# EAGLE schematic Melanie-AD (EAGLE 4.11)
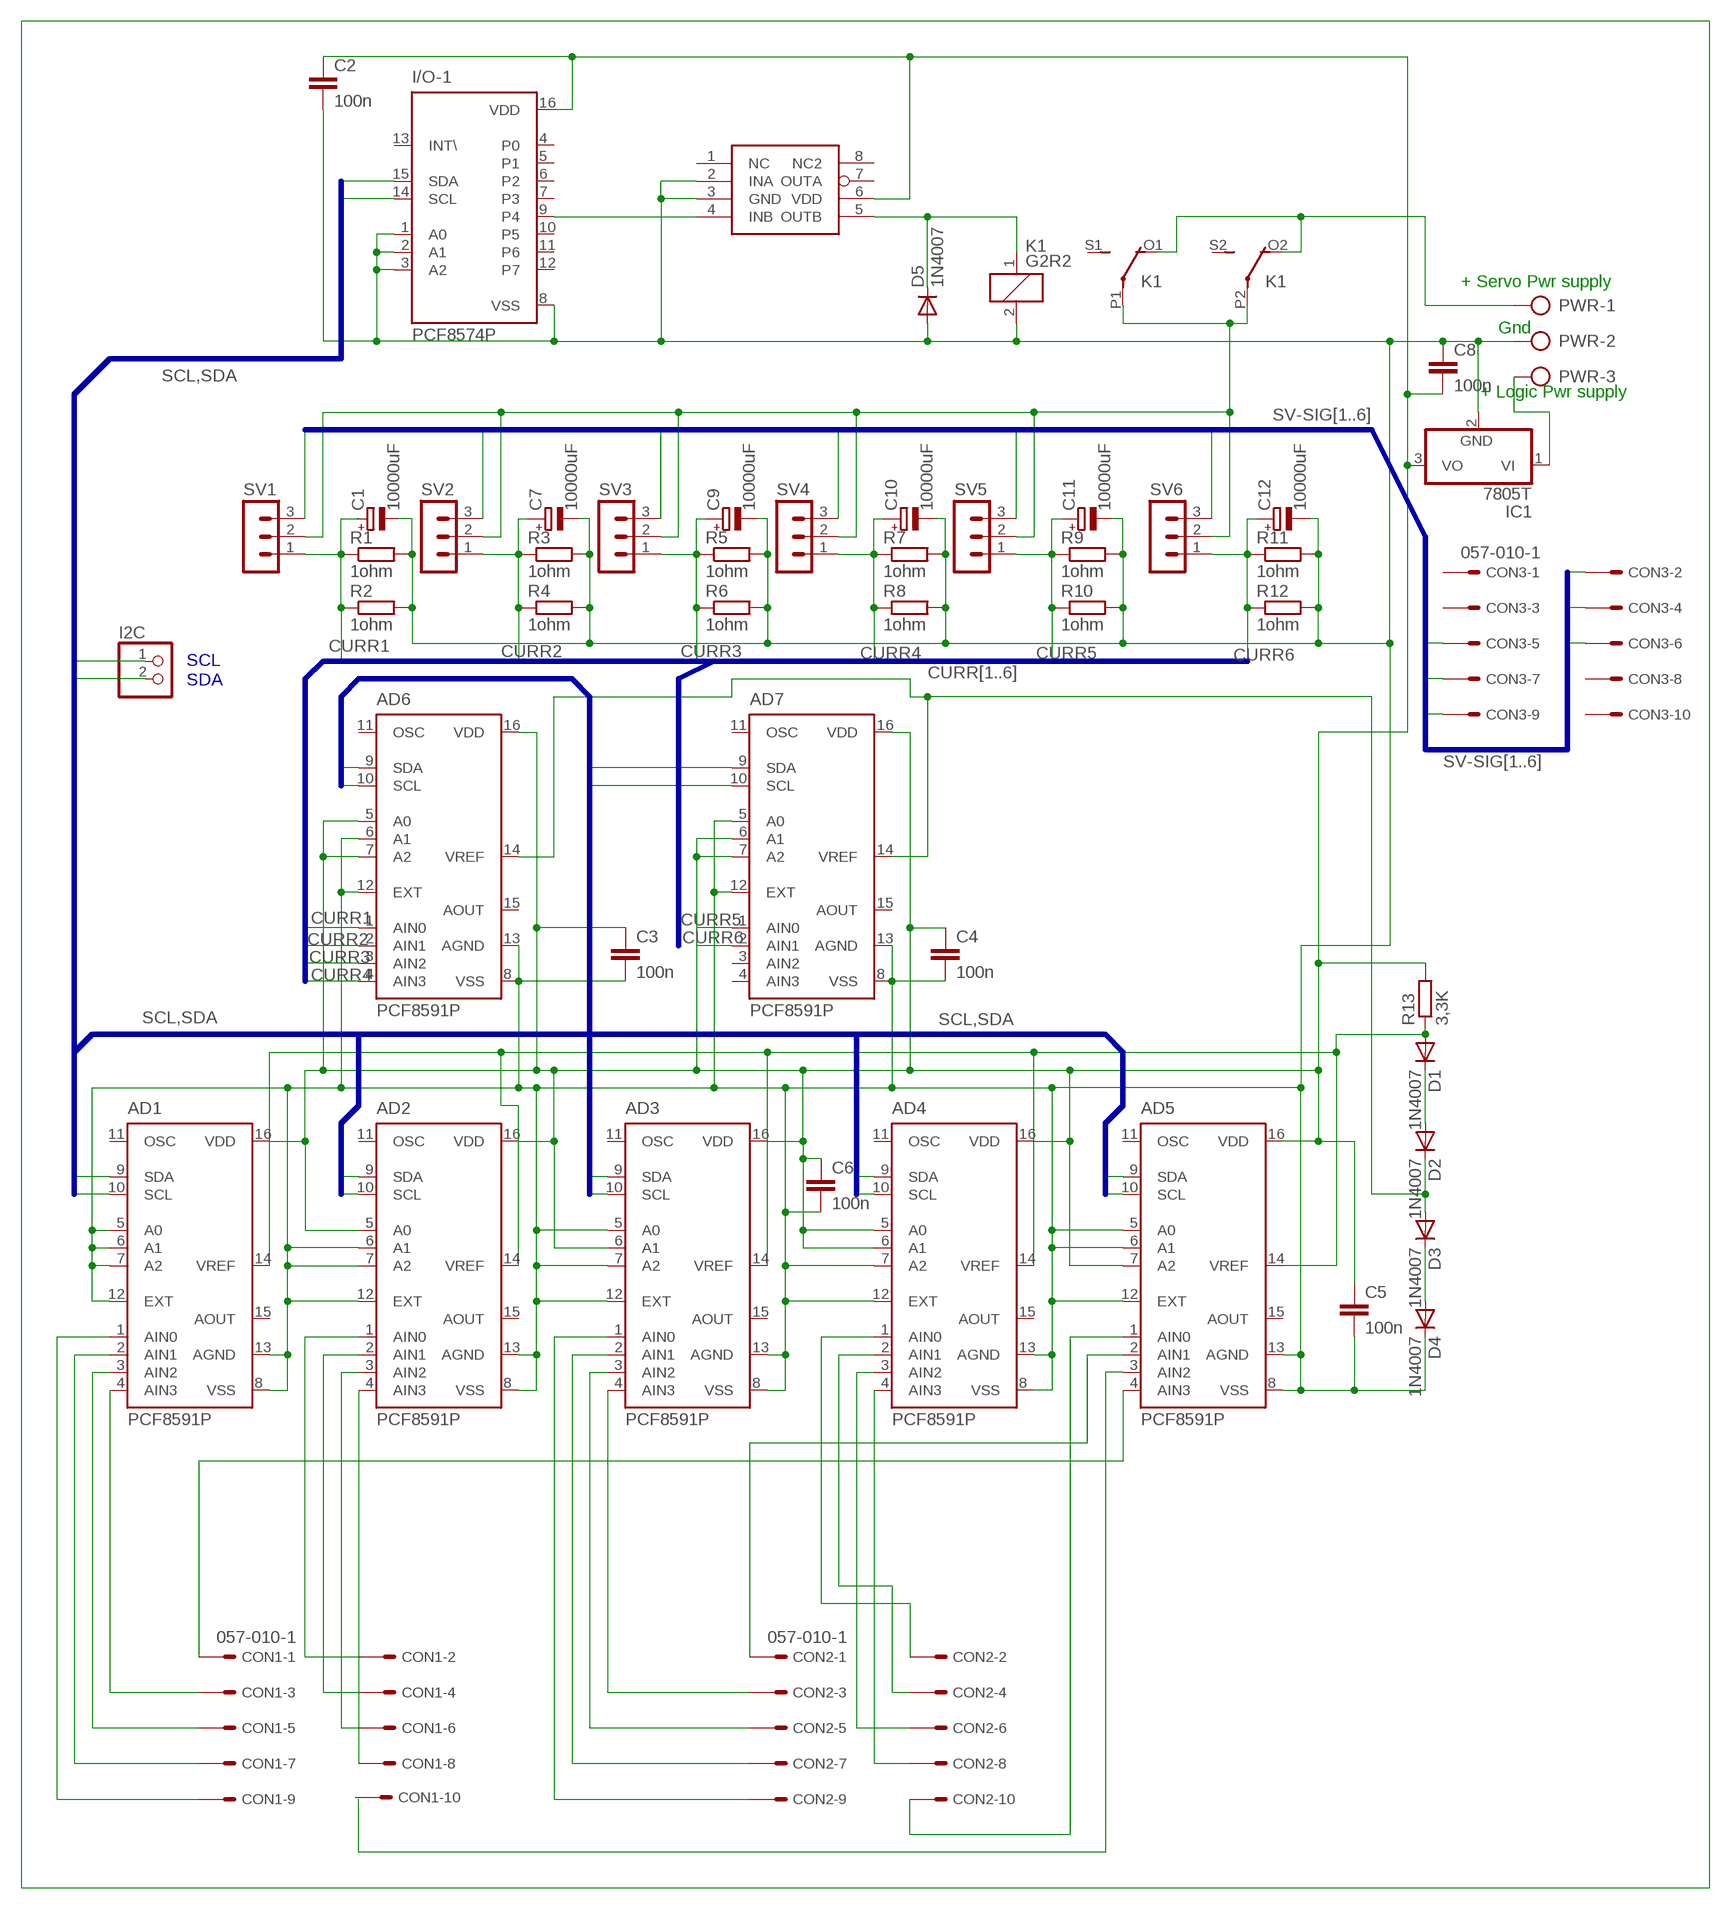
[diagram p0: schematic, sheet 1]

## Parts
AD1  PCF8591P  [DIL16]
AD2  PCF8591P  [DIL16]
AD3  PCF8591P  [DIL16]
AD4  PCF8591P  [DIL16]
AD5  PCF8591P  [DIL16]
AD6  PCF8591P  [DIL16]
AD7  PCF8591P  [DIL16]
C1  10000uF  CPOL-EUE10-22.5  [EB22,5D]
C2  100n  C-EU025-025X050  [C025-025X050]
C3  100n  C-EU025-025X050  [C025-025X050]
C4  100n  C-EU025-025X050  [C025-025X050]
C5  100n  C-EU025-025X050  [C025-025X050]
C6  100n  C-EU025-025X050  [C025-025X050]
C7  10000uF  CPOL-EUE10-22.5  [EB22,5D]
C8  100n  C-EU025-025X050  [C025-025X050]
C9  10000uF  CPOL-EUE10-22.5  [EB22,5D]
C10  10000uF  CPOL-EUE10-22.5  [EB22,5D]
C11  10000uF  CPOL-EUE10-22.5  [EB22,5D]
C12  10000uF  CPOL-EUE10-22.5  [EB22,5D]
CON1  057-010-1  [057-010-1]
CON2  057-010-1  [057-010-1]
CON3  057-010-1  [057-010-1]
D1  1N4007  1N4004  [DO41-10]
D2  1N4007  1N4004  [DO41-10]
D3  1N4007  1N4004  [DO41-10]
D4  1N4007  1N4004  [DO41-10]
D5  1N4007  1N4004  [DO41-10]
I2C  PINHD-1X2  [1X02]
I/O-1  PCF8574P  [DIL16]
IC1  7805T  [TO220H]
K1  G2R2  [G2R2]
PWR  AK300/3  [AK300/3]
R1  1ohm  R-EU_0414/5V  [0414V]
R2  1ohm  R-EU_0414/5V  [0414V]
R3  1ohm  R-EU_0414/5V  [0414V]
R4  1ohm  R-EU_0414/5V  [0414V]
R5  1ohm  R-EU_0414/5V  [0414V]
R6  1ohm  R-EU_0414/5V  [0414V]
R7  1ohm  R-EU_0414/5V  [0414V]
R8  1ohm  R-EU_0414/5V  [0414V]
R9  1ohm  R-EU_0414/5V  [0414V]
R10  1ohm  R-EU_0414/5V  [0414V]
R11  1ohm  R-EU_0414/5V  [0414V]
R12  1ohm  R-EU_0414/5V  [0414V]
R13  3,3K  R-EU_0309/10  [0309/10]
SV1  MA03-1  [MA03-1]
SV2  MA03-1  [MA03-1]
SV3  MA03-1  [MA03-1]
SV4  MA03-1  [MA03-1]
SV5  MA03-1  [MA03-1]
SV6  MA03-1  [MA03-1]
U$1  TC4425  [DIL08]

## Nets
CURR1: AD6.1(AIN0) R1.1 R2.1 SV1.1
CURR2: AD6.2(AIN1) C7.+ R3.1 R4.1 SV2.1
CURR3: AD6.3(AIN2) C9.+ R5.1 R6.1 SV3.1
CURR4: AD6.4(AIN3) C10.+ R7.1 R8.1 SV4.1
CURR5: AD7.1(AIN0) R9.1 R10.1 SV5.1
CURR6: AD7.2(AIN1) C12.+ R11.1 R12.1 SV6.1
N$1: AD1.1(AIN0) CON1.9
N$2: AD1.2(AIN1) CON1.7
N$3: AD1.3(AIN2) CON1.5
N$4: AD4.4(AIN3) CON2.8
N$5: AD2.1(AIN0) CON1.2
N$6: AD2.2(AIN1) CON1.4
N$7: AD2.3(AIN2) CON1.6
N$8: AD2.4(AIN3) CON1.8
N$9: AD3.1(AIN0) CON2.9
N$10: AD3.2(AIN1) CON2.7
N$11: AD3.3(AIN2) CON2.5
N$12: AD3.4(AIN3) CON2.3
N$13: AD4.3(AIN2) CON2.6
N$14: AD4.2(AIN1) CON2.4
N$15: AD4.1(AIN0) CON2.2
N$16: AD5.3(AIN2)
N$17: AD5.1(AIN0) CON2.10
N$18: AD5.2(AIN1) CON2.1
N$19: D3.C D4.A
N$20: K1.P1(2:P) K1.P2(3:P) SV1.2 SV2.2 SV3.2 SV4.2 SV5.2 SV6.2
N$21: AD1.4(AIN3) CON1.3
N$22: I/O-1.9(P4) U$1.4(INB)
N$23: D5.C K1.1 U$1.5(OUTB)
N$24: K1.O1(2:O) K1.O2(3:O) PWR.1
N$27: D1.C D2.A
N$28: AD5.4(AIN3) CON1.1
N$31: IC1.1(VI) PWR.3
SCL: AD1.10(SCL) AD2.10(SCL) AD3.10(SCL) AD4.10(SCL) AD5.10(SCL) AD6.10(SCL) AD7.10(SCL) I2C.1 I/O-1.14(SCL)
SDA: AD1.9(SDA) AD2.9(SDA) AD3.9(SDA) AD4.9(SDA) AD5.9(SDA) AD6.9(SDA) AD7.9(SDA) I2C.2 I/O-1.15(SDA)
SV-SIG1: CON3.2 SV1.3
SV-SIG2: CON3.4 SV2.3
SV-SIG3: CON3.6 SV3.3
SV-SIG4: CON3.9 SV4.3
SV-SIG5: CON3.7 SV5.3
SV-SIG6: CON3.5 SV6.3
VDD: AD1.16(VDD) AD2.5(A0) AD2.16(VDD) AD3.6(A1) AD3.16(VDD) AD4.5(A0) AD4.6(A1) AD4.16(VDD) AD5.7(A2) AD5.16(VDD) AD6.5(A0) AD6.7(A2) AD6.16(VDD) AD7.6(A1) AD7.7(A2) AD7.16(VDD) C2.1 C3.1 C4.1 C5.1 C6.1 C8.2 I/O-1.16(VDD) IC1.3(VO) R13.2 U$1.6(VDD)
VREF-CURR: AD6.14(VREF) AD7.14(VREF) D2.C D3.A
VREF-POT: AD1.14(VREF) AD2.14(VREF) AD3.14(VREF) AD4.14(VREF) AD5.14(VREF) D1.A R13.1
VSS: AD1.5(A0) AD1.6(A1) AD1.7(A2) AD1.8(VSS) AD1.12(EXT) AD1.13(AGND) AD2.6(A1) AD2.7(A2) AD2.8(VSS) AD2.12(EXT) AD2.13(AGND) AD3.5(A0) AD3.7(A2) AD3.8(VSS) AD3.12(EXT) AD3.13(AGND) AD4.7(A2) AD4.8(VSS) AD4.12(EXT) AD4.13(AGND) AD5.5(A0) AD5.6(A1) AD5.8(VSS) AD5.12(EXT) AD5.13(AGND) AD6.6(A1) AD6.8(VSS) AD6.12(EXT) AD6.13(AGND) AD7.5(A0) AD7.8(VSS) AD7.12(EXT) AD7.13(AGND) C2.2 C3.2 C4.2 C5.2 C6.2 C8.1 C10.- C12.- D4.C D5.A I/O-1.1(A0) I/O-1.2(A1) I/O-1.3(A2) I/O-1.8(VSS) IC1.2(GND) K1.2 PWR.2 R1.2 R2.2 R3.2 R4.2 R5.2 R6.2 R7.2 R8.2 R9.2 R10.2 R11.2 R12.2 U$1.2(INA) U$1.3(GND)
Unconnected: AD1.11(OSC) AD1.15(AOUT) AD2.11(OSC) AD2.15(AOUT) AD3.11(OSC) AD3.15(AOUT) AD4.11(OSC) AD4.15(AOUT) AD5.11(OSC) AD5.15(AOUT) AD6.11(OSC) AD6.15(AOUT) AD7.3(AIN2) AD7.4(AIN3) AD7.11(OSC) AD7.15(AOUT) C1.+ C1.- C7.- C9.- C11.+ C11.- CON1.10 CON3.1 CON3.3 CON3.8 CON3.10 I/O-1.4(P0) I/O-1.5(P1) I/O-1.6(P2) I/O-1.7(P3) I/O-1.10(P5) I/O-1.11(P6) I/O-1.12(P7) I/O-1.13(INT\) K1.S1(2:S) K1.S2(3:S) U$1.1(NC) U$1.7(OUTA) U$1.8(NC2)

## Buses
CURR[1..6]
SCL,SDA
SV-SIG[1..6]

## Notes on the sheet
- + Servo Pwr supply
- Gnd
- + Logic Pwr supply
- SCL
- SDA

## Library data of the parts
AD1-AD7 = micro-philips:PCF8591: I2C-Bus D/A CONVERTER
C1 C7 C9-C12 = rcl:CPOL-EU: POLARIZED CAPACITOR, European symbol
C2-C6 C8 = rcl:C-EU: CAPACITOR, European symbol
CON1-CON3 = con-panduit:057-010-: CONNECTOR 10-pin series 057 contact pc board low profile headers
D1-D5 = diode:1N4004: DIODE general purpose rectifier, 1 A
I2C = pinhead:PINHD-1X2: PIN HEADER
I/O-1 = micro-philips:PCF8574: I2C-Bus I/O DEVICE
IC1 = linear:78*: Positive VOLTAGE REGULATOR
K1 = relay:G2R2: RELAY 2 x switch, Omron
PWR = con-ptr500:AK300/3: CONNECTOR
R1-R13 = rcl:R-EU_: RESISTOR, European symbol
SV1-SV6 = con-lstb:MA03-1: PIN HEADER
U$1 = Otros:TC4425: TC4425 Dual Driver